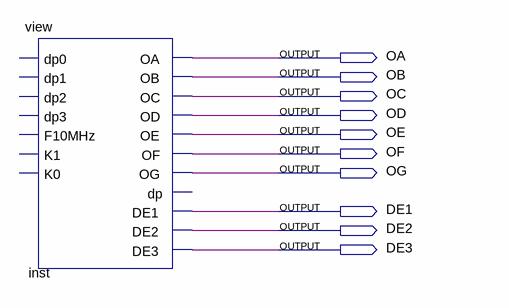
[diagram p0: schematic sheet]
// Quartus schematic viewnew.bdf as structural Verilog: 1 symbols, 10 pins
module viewnew (
  output OA,
  output OB,
  output OC,
  output OD,
  output OE,
  output OF,
  output OG,
  output DE1,
  output DE2,
  output DE3
);

  view inst (
    .OA(OA), .OB(OB), .OC(OC), .OD(OD), .OE(OE), .OF(OF), .OG(OG), .DE1(DE1), .DE2(DE2), .DE3(DE3));  // open: dp0, dp1, dp2, dp3, F10MHz, K1, K0, dp
endmodule
